# Altium schematic sheet common_power.SchDoc
size A3; SheetNumber: 1; SheetTotal: 1
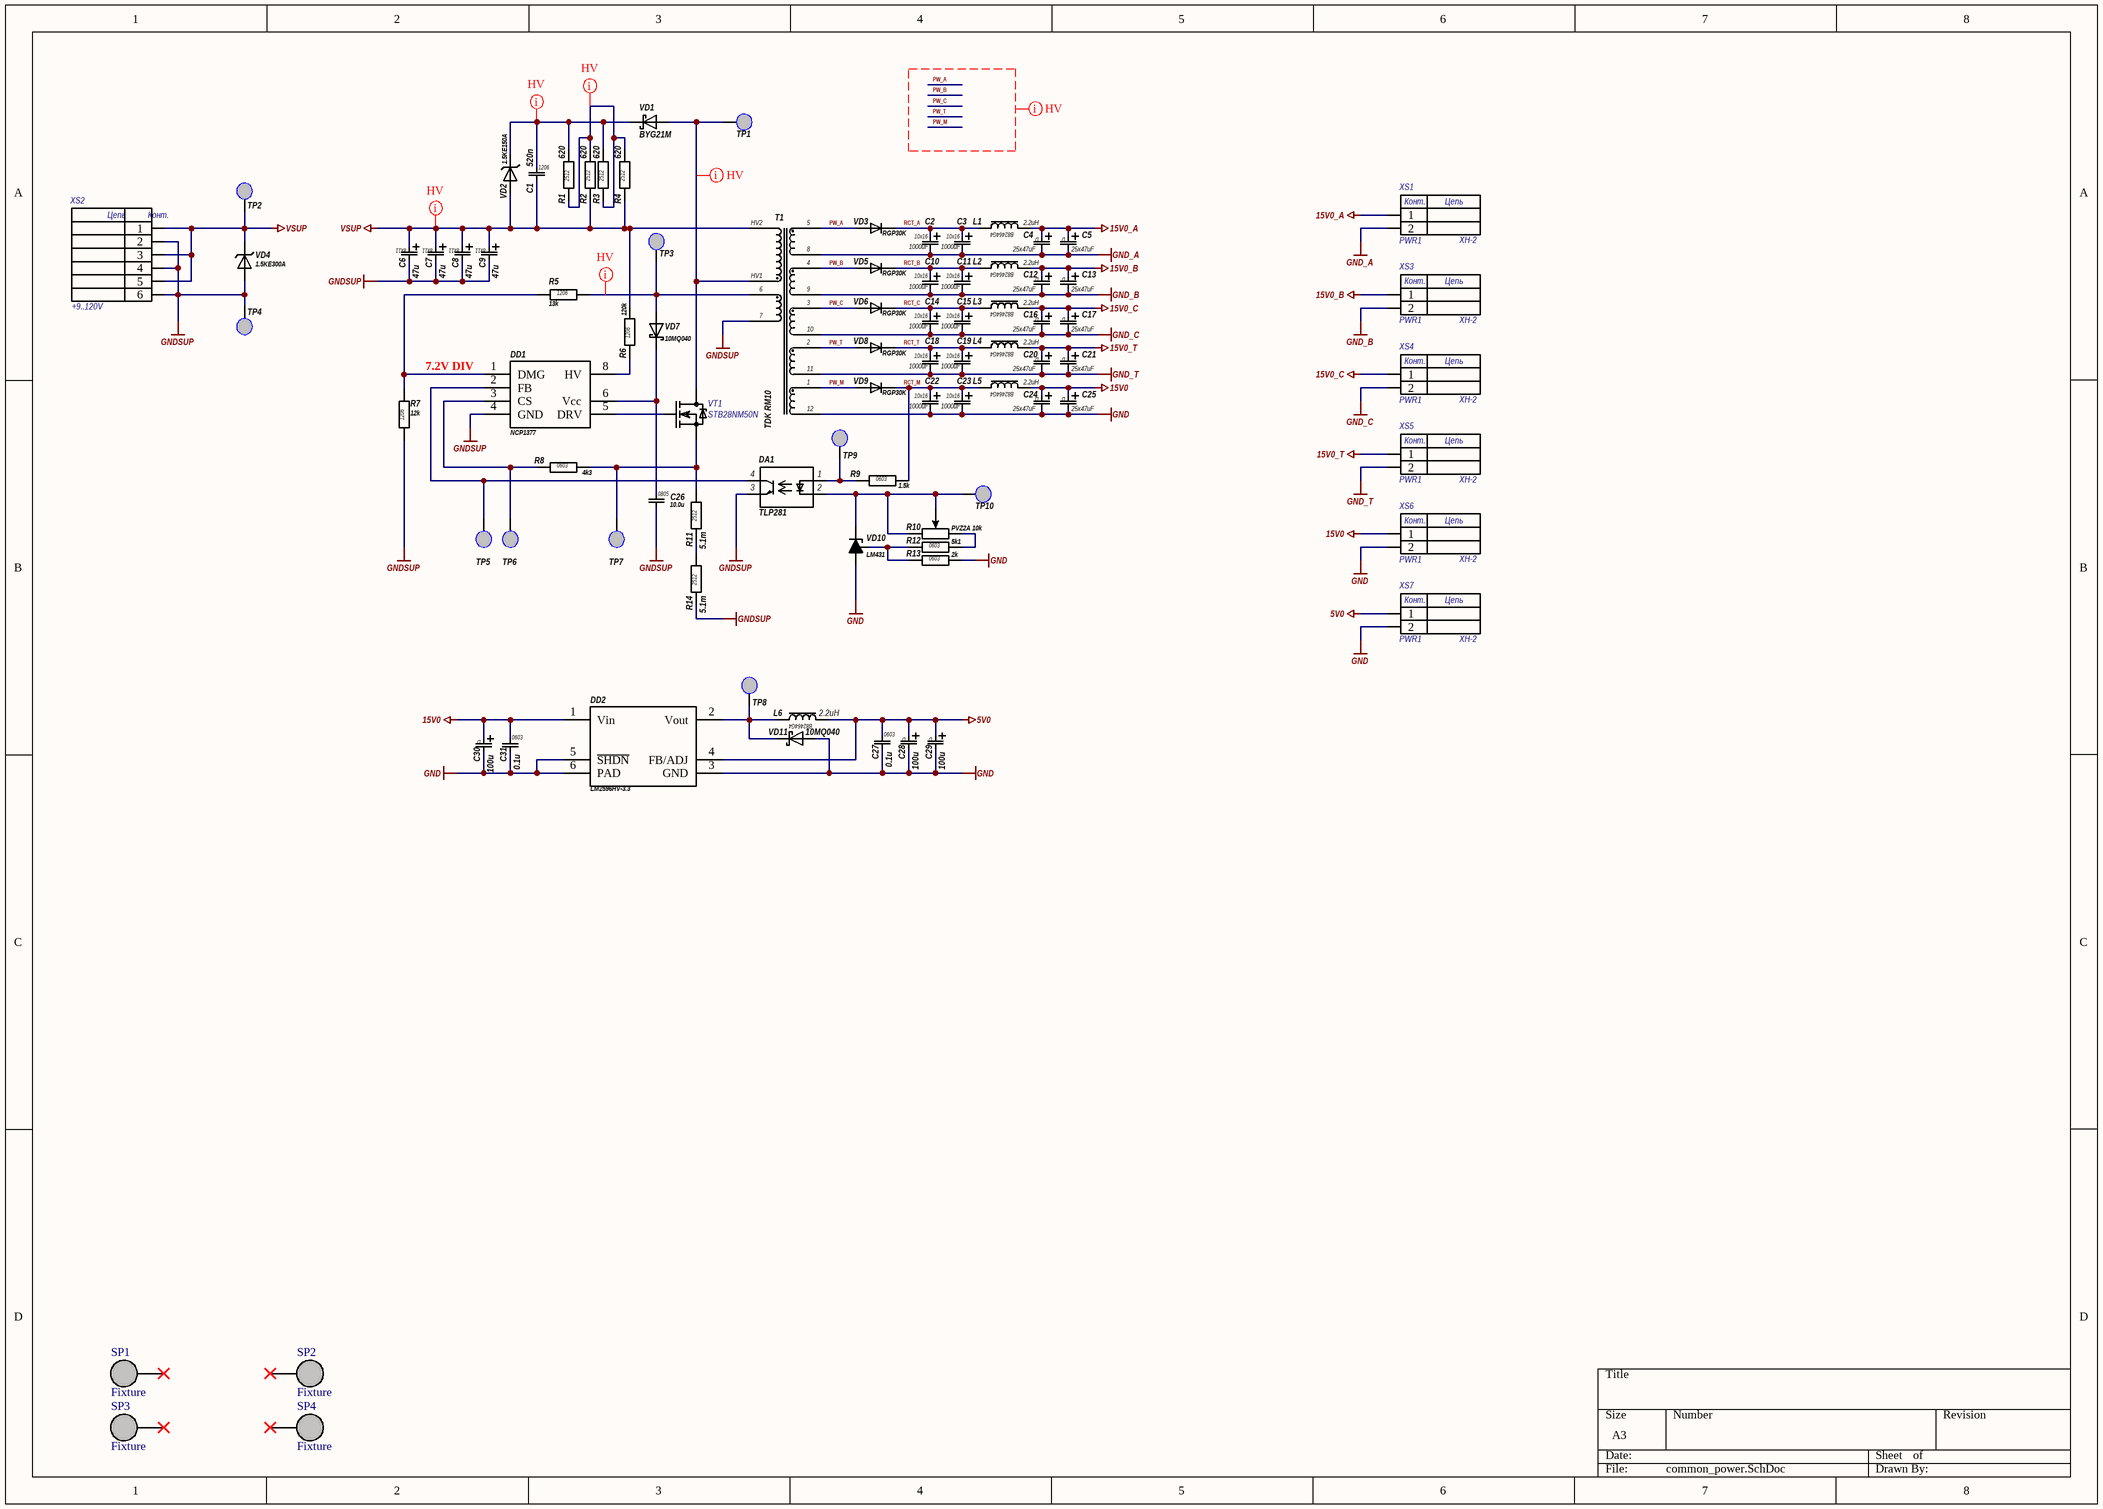
[diagram p0: common_power.SchDoc]

## Parts
C1  520n  [CAP1206]
C2  1000uF  [ECAP_10x16]
C3  1000uF  [ECAP_10x16]
C4  25x47uF  [CAP_D]
C5  25x47uF  [CAP_D]
C6  47u  [B41828 8X11.5]
C7  47u  [B41828 8X11.5]
C8  47u  [B41828 8X11.5]
C9  47u  [B41828 8X11.5]
C10  1000uF  [ECAP_10x16]
C11  1000uF  [ECAP_10x16]
C12  25x47uF  [CAP_D]
C13  25x47uF  [CAP_D]
C14  1000uF  [ECAP_10x16]
C15  1000uF  [ECAP_10x16]
C16  25x47uF  [CAP_D]
C17  25x47uF  [CAP_D]
C18  1000uF  [ECAP_10x16]
C19  1000uF  [ECAP_10x16]
C20  25x47uF  [CAP_D]
C21  25x47uF  [CAP_D]
C22  1000uF  [ECAP_10x16]
C23  1000uF  [ECAP_10x16]
C24  25x47uF  [CAP_D]
C25  25x47uF  [CAP_D]
C26  10.0u  [CAP0805]
C27  0.1u  [CAP0603]
C28  100u  [CAP_D]
C29  100u  [CAP_D]
C30  100u  [CAP_D]
C31  0.1u  [CAP0603]
DA1  TLP281  [SOIC-4]
DD1  NCP1377  [SO8_NCP1377]
DD2  LM2596HV-3.3  [TO-263-5]
L1  2.2uH  [B82464G4]
L2  2.2uH  [B82464G4]
L3  2.2uH  [B82464G4]
L4  2.2uH  [B82464G4]
L5  2.2uH  [B82464G4]
L6  2.2uH  [B82464G4]
R1  620  [RES2512]
R2  620  [RES2512]
R3  620  [RES2512]
R4  620  [RES2512]
R5  13k  [RES1206]
R6  120k  [RES1206]
R7  12k  [RES1206]
R8  4k3  [RES0603]
R9  1.5k  [RES0603]
R10  PVZ2A 10k  [PVZ2A]
R11  5.1m  [RES2512]
R12  5k1  [RES0603]
R13  2k  [RES0603]
R14  5.1m  [RES2512]
SP1  Fixture  [FIXTURE_HOLE_3mm]
SP2  Fixture  [FIXTURE_HOLE_3mm]
SP3  Fixture  [FIXTURE_HOLE_3mm]
SP4  Fixture  [FIXTURE_HOLE_3mm]
T1  TDK RM10  [TDK RM8 HV ADD]
TP1  Test point  [TESTPOINT_HOLE]  (value not drawn)
TP2  Test point  [TESTPOINT_HOLE]  (value not drawn)
TP3  Test point  [TESTPOINT_HOLE]  (value not drawn)
TP4  Test point  [TESTPOINT_HOLE]  (value not drawn)
TP5  Test point  [TESTPOINT_HOLE]  (value not drawn)
TP6  Test point  [TESTPOINT_HOLE]  (value not drawn)
TP7  Test point  [TESTPOINT_HOLE]  (value not drawn)
TP8  Test point  [TESTPOINT_HOLE]  (value not drawn)
TP9  Test point  [TESTPOINT_HOLE]  (value not drawn)
TP10  Test point  [TESTPOINT_HOLE]  (value not drawn)
VD1  BYG21M  [SMA]
VD2  1.5KE150A  [DO-27]
VD3  RGP30K  [DO-201_H]
VD4  1.5KE300A  [DO-27]
VD5  RGP30K  [DO-201_H]
VD6  RGP30K  [DO-201_H]
VD7  10MQ040  [SMA]
VD8  RGP30K  [DO-201_H]
VD9  RGP30K  [DO-201_H]
VD10  LM431  [SOT23-3]
VD11  10MQ040  [SMA]
VT1  STB28NM50N  [D2PAK]
XS1  XH-2  value PWR1  [XH-2]
XS2  +9..120V  [MF2X3R_FIX]
XS3  XH-2  value PWR1  [XH-2]
XS4  XH-2  value PWR1  [XH-2]
XS5  XH-2  value PWR1  [XH-2]
XS6  XH-2  value PWR1  [XH-2]
XS7  XH-2  value PWR1  [XH-2]

## Nets
5V0: C27.1 C28.1 C29.1 DD2.4(FB/ADJ) L6.2 XS7.1
15V0: C24.1 C25.1 C30.1 C31.1 DD2.1(Vin) L5.2 XS6.1
15V0_A: C4.1 C5.1 L1.2 XS1.1
15V0_B: C12.1 C13.1 L2.2 XS3.1
15V0_C: C16.1 C17.1 L3.2 XS4.1
15V0_T: C20.1 C21.1 L4.2 XS5.1
GND: C22.2 C23.2 C24.2 C25.2 C27.2 C28.2 C29.2 C30.2 C31.2 DD2.3(GND) DD2.5(~{SHDN}) DD2.6(PAD) R13.2 T1.12 VD10.3 VD11.1 XS6.2 XS7.2
GND_A: C2.2 C3.2 C4.2 C5.2 T1.8 XS1.2
GND_B: C10.2 C11.2 C12.2 C13.2 T1.9 XS3.2
GND_C: C14.2 C15.2 C16.2 C17.2 T1.10 XS4.2
GND_T: C18.2 C19.2 C20.2 C21.2 T1.11 XS5.2
GNDSUP: C6.2 C7.2 C8.2 C9.2 C26.2 DA1.3 DD1.4(GND) R7.1 R14.1 T1.7 TP4.1(TP) VD4.A XS2.2 XS2.4 XS2.6
VSUP: C1.2 C6.1 C7.1 C8.1 C9.1 R2.1 R4.1 R6.2 T1.HV2 TP2.1(TP) VD2.A VD4.K XS2.1 XS2.3 XS2.5
PW_A: T1.5 VD3.A
PW_B: T1.4 VD5.A
PW_C: T1.3 VD6.A
PW_M: T1.1 VD9.A
PW_T: T1.2 VD8.A
RCT_A: C2.1 C3.1 L1.1 VD3.K
RCT_B: C10.1 C11.1 L2.1 VD5.K
RCT_C: C14.1 C15.1 L3.1 VD6.K
RCT_M: C22.1 C23.1 L5.1 R9.2 VD9.K
RCT_T: C18.1 C19.1 L4.1 VD8.K
NetC1_1: C1.1 R1.2 R3.2 VD1.2 VD2.K
NetC26_1: C26.1 DD1.6(Vcc) VD7.2
NetDA1_1: DA1.1 R9.1 TP9.1(TP)
NetDA1_2: DA1.2 R10.1 R10.2 TP10.1(TP) VD10.1
NetDA1_4: DA1.4 DD1.2(FB) TP5.1(TP)
NetDD1_1: DD1.1(DMG) R5.1 R7.2
NetDD1_3: DD1.3(CS) R8.1 TP6.1(TP)
NetDD1_5: DD1.5(DRV) VT1.1
NetDD1_8: DD1.8(HV) R6.1
NetDD2_2: DD2.2(Vout) L6.1 TP8.1(TP) VD11.2
NetR1_1: R1.1 R2.2 R3.1 R4.2
NetR5_2: R5.2 T1.6 TP3.1(TP) VD7.1
NetR8_2: R8.2 R11.2 TP7.1(TP) VT1.2
NetR10_3: R10.3 R12.2
NetR11_1: R11.1 R14.2
NetR12_1: R12.1 R13.1 VD10.2
NetT1_HV1: T1.HV1 TP1.1(TP) VD1.1 VT1.3

Not connected (* = marked no-connect by the designer): SP1 S*; SP2 S*; SP3 S*; SP4 S*

## Layout directives
net class HV: NetC1_1, NetR1_1, NetR5_2, NetT1_HV1, PW_A, PW_B, PW_C, PW_M, PW_T, VSUP

## Notes on the sheet
- 7.2V DIV
- (in symbol CAP_10x16) 10x16
- (in symbol CAP_B41828 8X11.5) 8x11
- (in symbol CONN_MW-2M) Конт.; Цепь
- (in symbol IND_B82464G4) B82464G4
- (in symbol MF2X3R_FIX) Цепь; Конт.

## Library data of the parts
C1 = CAP_1206: Конденсатор чип; Тип корпуса: 1206; Тип монтажа: Поверхностный; Номинал: 520n; Тип компонента: Конденсатор чип
C2 C3 C10 C11 C14 C15 C18 C19 C22 C23 = CAP_10x16: Конденсатор электролитический; Номинал: {Value}; Производитель: Epcos; Тип монтажа: Штыревой; Тип: 8x11.5; Value: {Value}; Тип компонента: Конденсатор электролитический
C4 C5 C12 C13 C16 C17 C20 C21 C24 C25 = CAP_D: Конденсатор танталовый; Номинал: {Value}; Тип корпуса: Тип D; Тип монтажа: Поверхностный; Тип: D; Value: {Value}; Тип компонента: Конденсатор танталовый
C6-C9 = CAP_B41828 8X11.5: Конденсатор электролитический; Номинал: {Value}; Производитель: Epcos; Тип монтажа: Штыревой; Тип: 8x11.5; Value: {Value}; Тип компонента: Конденсатор электролитический
C26 = CAP_0805: Конденсатор чип; Тип корпуса: 0805; Тип монтажа: Поверхностный; Номинал: 10.0u; Тип компонента: Конденсатор чип
C27 C31 = CAP_0603: Конденсатор чип; Тип корпуса: 0603; Тип монтажа: Поверхностный; Номинал: 0.1u; Тип компонента: Конденсатор чип
C28-C30 = CAP_D: Конденсатор танталовый; Тип корпуса: Тип D; Тип монтажа: Поверхностный; Тип: D; Номинал: 100u; Тип компонента: Конденсатор танталовый; Value: 100u
DA1 = TPL281-1: Оптопара; Производитель: Toshiba; Тип монтажа: Поверхностный; Характеристики: 80В 50мА; Наименование: TLP281; Тип компонента: Оптопара; Тип корпуса: SOIC-4
DD1 = NCP1377: Контроллер обратноходового преобразователя
DD2 = LM2596HV-x.x: Понижающий DC-DC преобразователь с широким диапазоном входного напряжения (Vin=4.5..60V)
L1-L6 = IND_B82464G4: Индуктивность чип; Номинал: {Value}; Производитель: Epcos; Тип корпуса: SMT; Тип монтажа: Поверхностный; Value: {Value}; Тип компонента: Индуктивность чип
R1-R4 R11 R14 = RES_2512: Резистор чип; Номинал: {Value}; Тип корпуса: 2512; Тип монтажа: Поверхностный; Характеристики: 1.0Вт 200В; Value: {Value}; Тип компонента: Резистор чип
R5-R7 = RES_1206: Резистор чип; Номинал: {Value}; Тип корпуса: 1206; Тип монтажа: Поверхностный; Характеристики: 0.25Вт 200В; Value: {Value}; Тип компонента: Резистор чип
R8 R9 R12 R13 = RES_0603: Резистор чип; Номинал: Value; Тип корпуса: 0603; Тип монтажа: Поверхностный; Характеристики: 0.1Вт 50В; Тип компонента: Резистор чип; Value: Value
R10 = PVZ2A: Резистор подстроечный; Наименование: Murata, PVZ2A; Номинал: {Value}; Тип монтажа: Штыревой; Value: {Value}; Тип компонента: Резистор подстроечный
SP1-SP4 = Structural Pad: Structural screw pad
T1 = TRANS_Flyback_MDrive
VD1 = SX34: Диод Шоттки; Производитель: WTE; Тип монтажа: Поверхностный; Характеристики: 28В 3А; Тип компонента: Диод Шоттки; Тип корпуса: SMA; Наименование: BYG21M
VD2 VD4 = 1.5KExxxA: Диод TVS; Тип корпуса: SMC; Тип монтажа: Поверхностный; Характеристики: 1500 Вт; Тип компонента: Диод TVS
  VD2: Наименование: 1.5KE150A
  VD4: Наименование: 1.5KE300A
VD3 VD5 VD6 VD8 VD9 = RGP30K: Диод выпрямительный 800В 3А; Наименование: DL4148; Номинал: {Value}; Тип корпуса: DO-35; Тип монтажа: Поверхностный; Value: {Value}; Тип компонента: Диод выпрямительный 800В 3А
VD7 VD11 = 10MQ040: Диод Шоттки; Производитель: WTE; Тип монтажа: Поверхностный; Характеристики: 40В 1А; Тип компонента: Диод Шоттки; Тип корпуса: SMA; Наименование: 10MQ040
VD10 = LM431: Программируемый стабилитрон; Производитель: Vishay; Тип корпуса: SOD323; Тип монтажа: Поверхностный; Характеристики: 2.4-75В 5мА; Тип компонента: Программируемый стабилитрон; Наименование: LM431
VT1 = IRF2807: Транзистор полевой (MOSFET); Value: {Value}; Наименование: International Rectifier, IRF2807S; Тип монтажа: Поверхностный; Номинал: {Value}; Тип компонента: Транзистор полевой (MOSFET); Тип корпуса: D2PAK
XS1 XS3-XS7 = CONN_MW-2M: Разъем; Наименование: MW-2M; Тип корпуса: шаг 2 мм; Тип монтажа: Штыревой; Тип компонента: Разъем
XS2 = MF2X3R_FIX: Разъем; Наименование: MiniFit 2X3R_FIX; Тип корпуса: шаг 4,2 мм; Тип монтажа: Штыревой; Value: {Value}; Тип компонента: Разъем